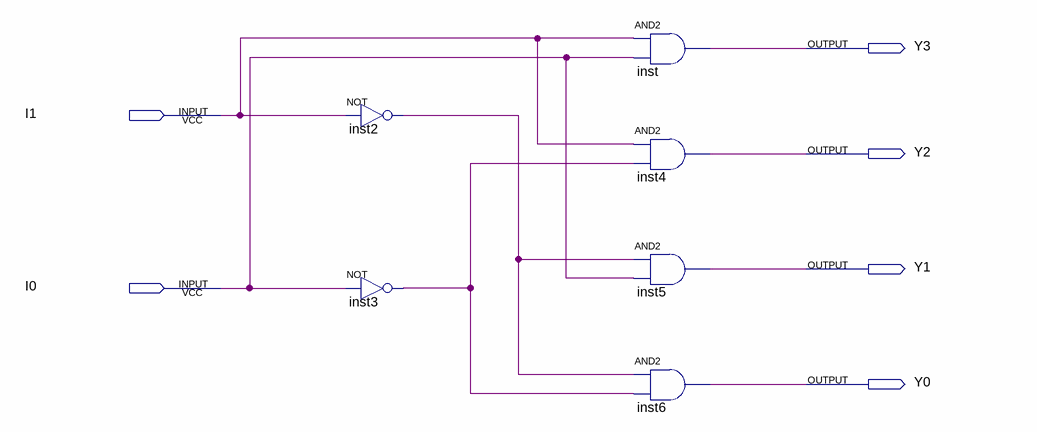
[diagram p0: schematic sheet]
// Quartus schematic My_24_decoder.bdf as structural Verilog: 6 symbols, 6 pins
module My_24_decoder (
  input  I1,
  input  I0,
  output Y3,
  output Y2,
  output Y1,
  output Y0
);

  wire inst2_out, inst3_out;

  not inst2 (inst2_out, I1);
  not inst3 (inst3_out, I0);
  and inst (Y3, I1, I0);
  and inst4 (Y2, I1, inst3_out);
  and inst5 (Y1, inst2_out, I0);
  and inst6 (Y0, inst2_out, inst3_out);
endmodule
